# EAGLE design countdown4digit (EAGLE 6.4)
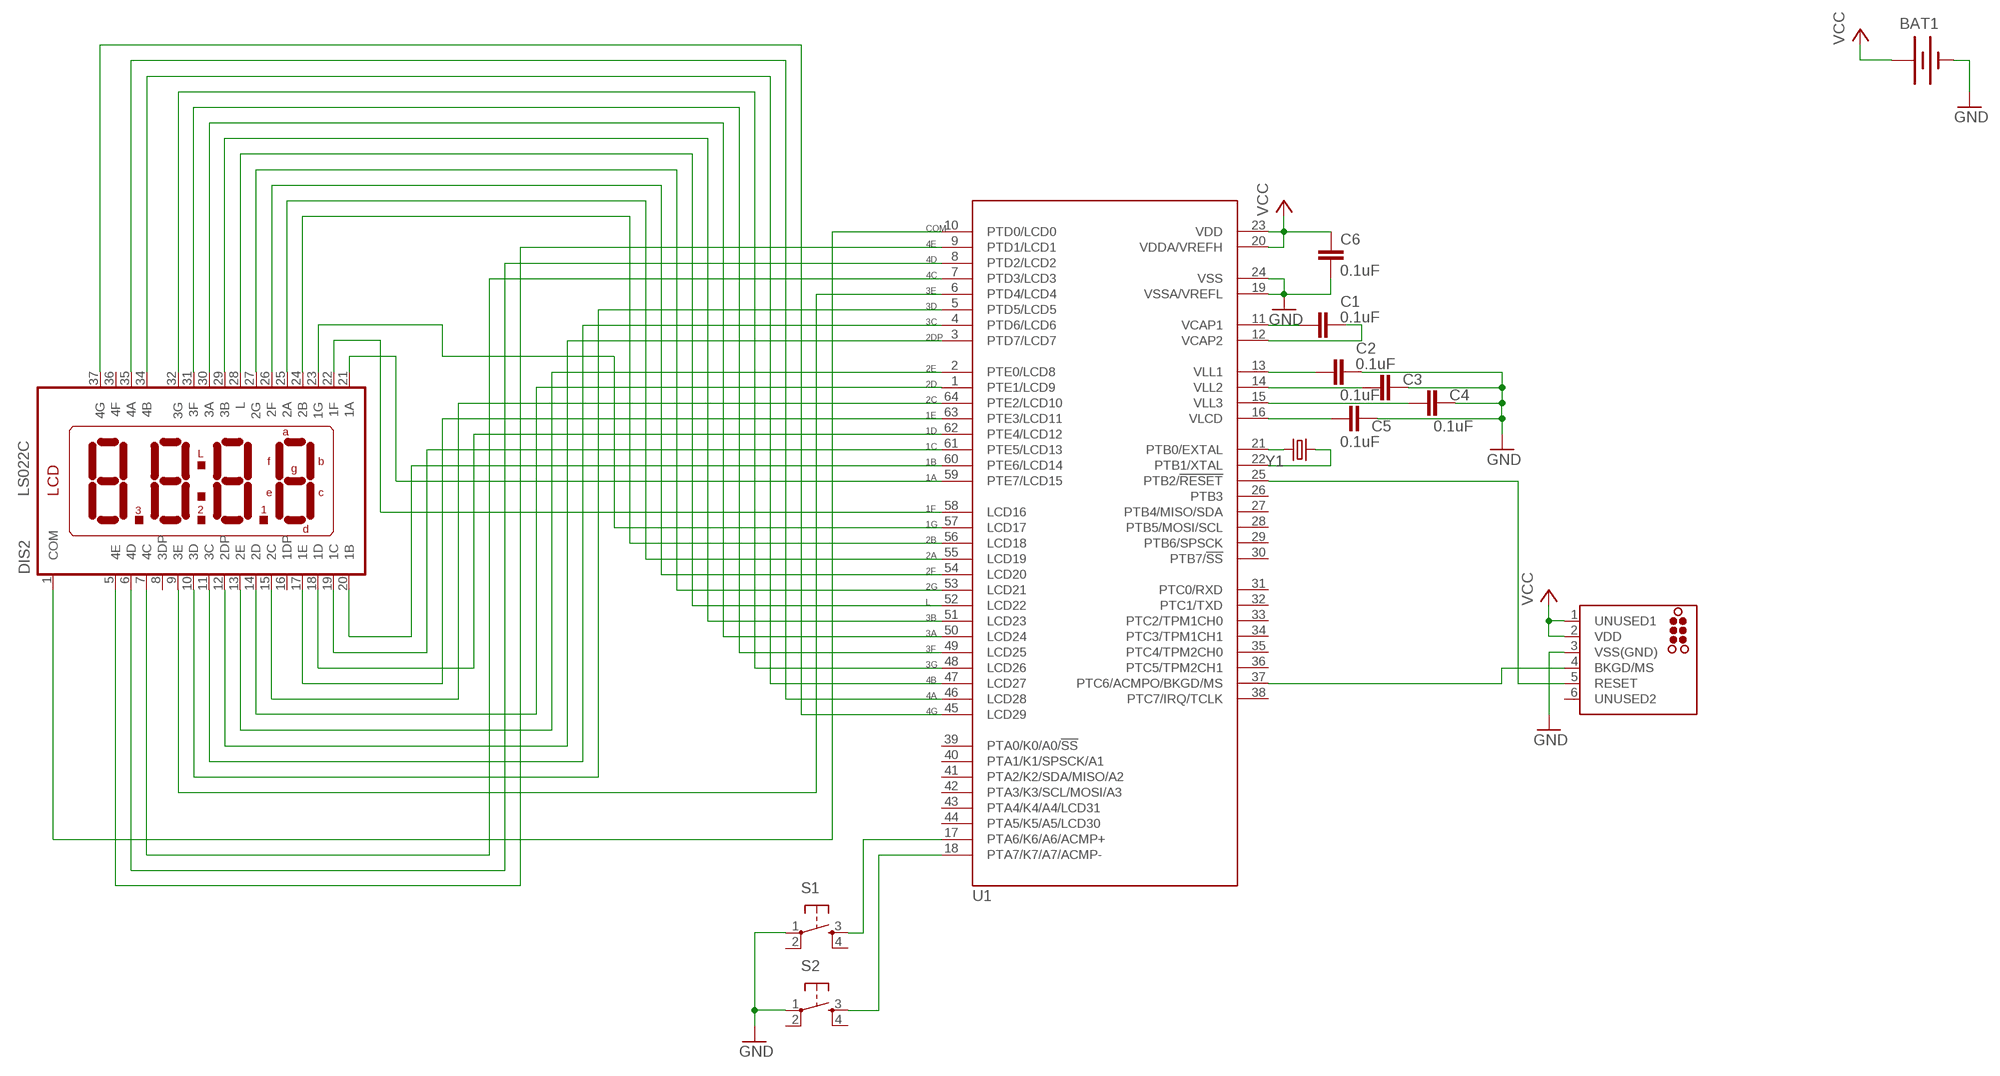
[diagram p0: schematic, sheet 1]

## Parts
BAT1  BATTERY12MM  [BATTCON_12MM]
BDM  TC2030-MCP-NL  [TC2030-MCP-NL]
C1  0.1uF  C-EUC0603K  [C0603K]
C2  0.1uF  C-EUC0603K  [C0603K]
C3  0.1uF  C-EUC0603K  [C0603K]
C4  0.1uF  C-EUC0603K  [C0603K]
C5  0.1uF  C-EUC0603K  [C0603K]
C6  0.1uF  C-EUC0603K  [C0603K]
DIS2  LS022C  [LS022C]
S1  TAC_SWITCHSMD  [TACTILE_SWITCH_SMD]
S2  TAC_SWITCHSMD  [TACTILE_SWITCH_SMD]
U1  MC9S08LL16  [LQFP64]
Y1  CRYSTALTC26H  [TC26H]

## Nets
1A: DIS2.21(1A) U1.59(PTE7/LCD15)
1B: DIS2.20(1B) U1.60(PTE6/LCD14)
1C: DIS2.19(1C) U1.61(PTE5/LCD13)
1D: DIS2.18(1D) U1.62(PTE4/LCD12)
1E: DIS2.17(1E) U1.63(PTE3/LCD11)
1F: DIS2.22(1F) U1.58(LCD16)
1G: DIS2.23(1G) U1.57(LCD17)
2A: DIS2.25(2A) U1.55(LCD19)
2B: DIS2.24(2B) U1.56(LCD18)
2C: DIS2.15(2C) U1.64(PTE2/LCD10)
2D: DIS2.14(2D) U1.1(PTE1/LCD9)
2DP: DIS2.12(2DP) U1.3(PTD7/LCD7)
2E: DIS2.13(2E) U1.2(PTE0/LCD8)
2F: DIS2.26(2F) U1.54(LCD20)
2G: DIS2.27(2G) U1.53(LCD21)
3A: DIS2.30(3A) U1.50(LCD24)
3B: DIS2.29(3B) U1.51(LCD23)
3C: DIS2.11(3C) U1.4(PTD6/LCD6)
3D: DIS2.10(3D) U1.5(PTD5/LCD5)
3E: DIS2.9(3E) U1.6(PTD4/LCD4)
3F: DIS2.31(3F) U1.49(LCD25)
3G: DIS2.32(3G) U1.48(LCD26)
4A: DIS2.35(4A) U1.46(LCD28)
4B: DIS2.34(4B) U1.47(LCD27)
4C: DIS2.7(4C) U1.7(PTD3/LCD3)
4D: DIS2.6(4D) U1.8(PTD2/LCD2)
4E: DIS2.5(4E) U1.9(PTD1/LCD1)
4G: DIS2.37(4G) U1.45(LCD29)
COM: DIS2.1(COM) U1.10(PTD0/LCD0)
GND: BAT1.GND(-) BDM.3(VSS(GND)) C2.1 C3.1 C4.1 C5.1 C6.2 S1.1 S2.1 U1.19(VSSA/VREFL) U1.24(VSS)
L: DIS2.28(L) U1.52(LCD22)
N$31: C1.2 U1.11(VCAP1)
N$32: C1.1 U1.12(VCAP2)
N$33: C2.2 U1.13(VLL1)
N$34: C3.2 U1.14(VLL2)
N$35: C4.2 U1.15(VLL3)
N$36: C5.2 U1.16(VLCD)
N$37: U1.21(PTB0/EXTAL) Y1.2
N$38: U1.22(PTB1/XTAL) Y1.1
N$39: BDM.4(BKGD/MS) U1.37(PTC6/ACMPO/BKGD/MS)
N$40: BDM.5(RESET) U1.25(PTB2/!RESET)
N$41: S1.3 U1.17(PTA6/K6/A6/ACMP+)
N$42: S2.3 U1.18(PTA7/K7/A7/ACMP-)
VCC: BAT1.PWR@1(+) BDM.1(UNUSED1) BDM.2(VDD) C6.1 U1.20(VDDA/VREFH) U1.23(VDD)
Unconnected: BDM.6(UNUSED2) DIS2.8(3DP) DIS2.16(1DP) DIS2.36(4F) S1.2 S1.4 S2.2 S2.4 U1.26(PTB3) U1.27(PTB4/MISO/SDA) U1.28(PTB5/MOSI/SCL) U1.29(PTB6/SPSCK) U1.30(PTB7/!SS) U1.31(PTC0/RXD) U1.32(PTC1/TXD) U1.33(PTC2/TPM1CH0) U1.34(PTC3/TPM1CH1) U1.35(PTC4/TPM2CH0) U1.36(PTC5/TPM2CH1) U1.38(PTC7/IRQ/TCLK) U1.39(PTA0/K0/A0/!SS) U1.40(PTA1/K1/SPSCK/A1) U1.41(PTA2/K2/SDA/MISO/A2) U1.42(PTA3/K3/SCL/MOSI/A3) U1.43(PTA4/K4/A4/LCD31) U1.44(PTA5/K5/A5/LCD30)

## Library data of the parts
BAT1 = SparkFun:BATTERY: Battery Holders Various common sizes : AA, AAA, 20mm coin cell and 12mm coin cell.
BDM = scott:TC2030: TAG-CONNECT ISP Connector Manufacturer: Tag-Connect <www.tag-connect.com> Cable for easy In-Circuit PCB Programming. Designed for Microchip ICD2, suitable for many others. Two variants - one "with legs" (for hads-free fit on PCB) and another "without legs" for quick programming. PAD Description 1 MCLR/Vpp 2 Vdd 3 GND 4 PGD (ISPDAT) 5 PGC (ISPCLK) 6 nc (used for LVP) ©2009 ROFA.cz
C1-C6 = rcl:C-EU: CAPACITOR, European symbol
DIS2 = display-lcd:LS022C: LCD DISPLAY 4-character 7 segment; OC_FARNELL: unknown; OC_NEWARK: unknown
S1 S2 = SparkFun:TAC_SWITCH: Momentary Switch Button commonly used for reset or general input. Spark Fun Electronics SKU : COM-00097
U1 = scott:MC9S08LL16
Y1 = crystal:CRYSTAL: CRYSTAL; OC_FARNELL: unknown; OC_NEWARK: unknown

## Board
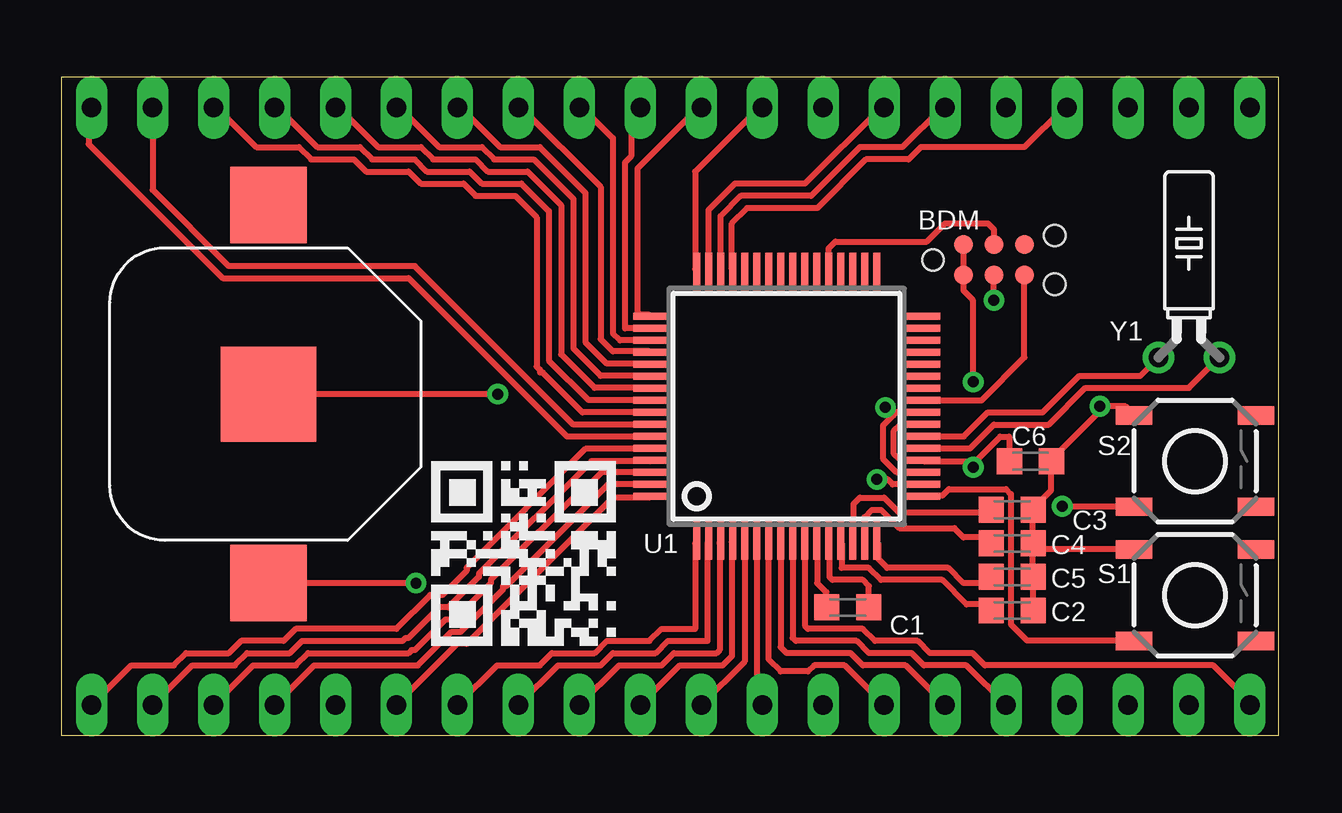
[diagram p1: board, top side]
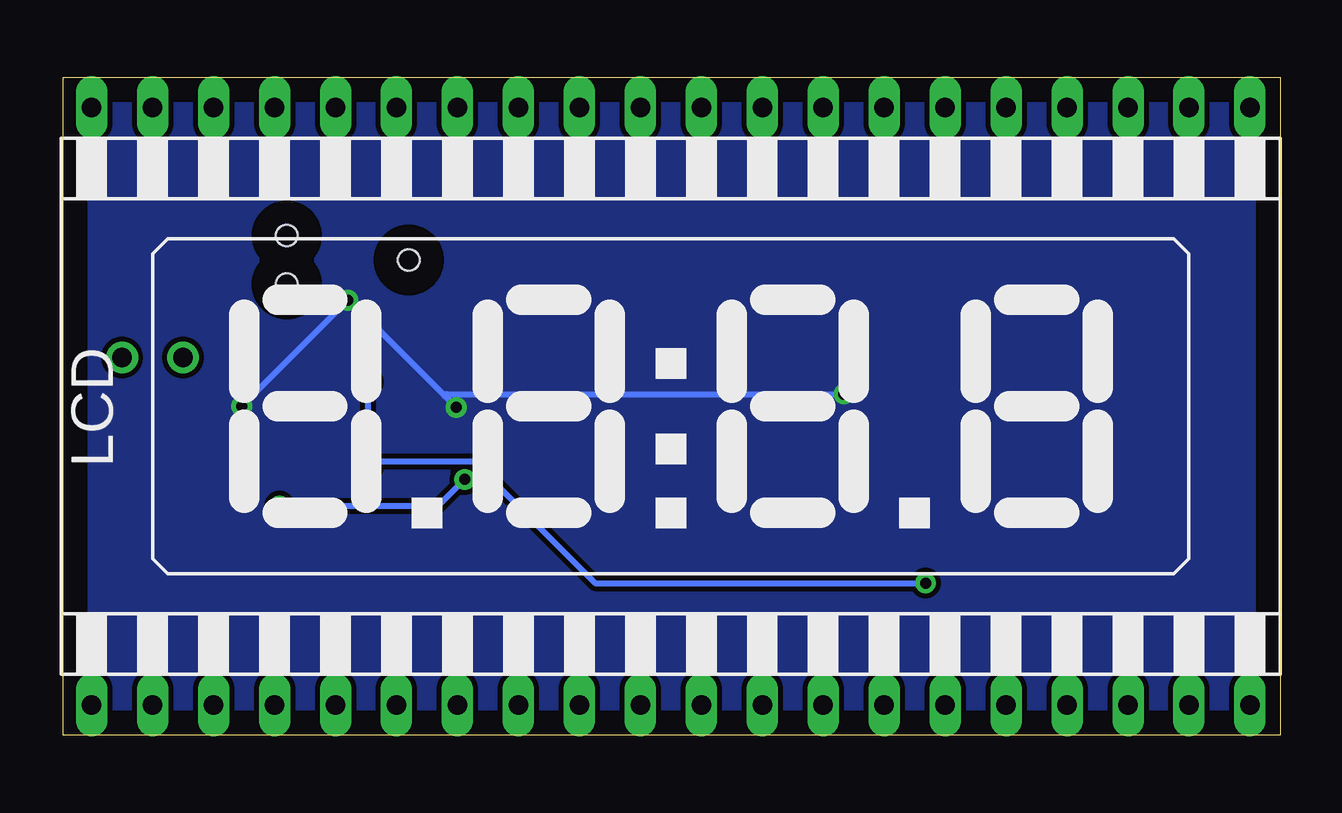
[diagram p2: board, bottom side, seen from below]

Size 50.72 x 27.42 mm. Coordinates in mm from the lower left corner, seen from the top.
Outline: 0,0 50.72,0 50.72,27.42 0,27.42 0,0
Copper layers (1*16): Top 0.035mm / dielectric 1.5mm / Bottom 0.035mm
Design rules "default *": minimum track width 10mil, minimum drill 18mil, track to track 8mil, track to pad 6mil, pad to pad 6mil, via to via 8mil, smd to smd 6mil, copper to edge 40mil, drill to drill 8mil, minimum pad ring 10mil, minimum via ring 8mil, stop-mask expansion 4mil, vias tented up to drill 0mil, thermal gap 10mil

### Footprints (pad centres in the part's own frame; a part is rotated, then mirrored left to right if it is on the bottom)
BATTCON_12MM = smd 3.962 x 3.962: GND 0,0 | smd 3.175 x 3.175: PWR@1 -7.874,0; PWR@2 7.874,0
TC2030-MCP-NL = smd 0.787 x 0.787: 1 1.27,-0.635; 2 1.27,0.635; 3 2.54,-0.635; 4 2.54,0.635; 5 3.81,-0.635; 6 3.81,0.635 | hole 0.889: 0,0; 5.08,-1.016; 5.08,1.016
C0603K = smd 1.05 x 1.08: 1 -0.875,0; 2 0.875,0
LS022C = drill 0.813 long: 1 -24.13,-12.446; 2 -21.59,-12.446; 3 -19.05,-12.446; 4 -16.51,-12.446; 5 -13.97,-12.446; 6 -11.43,-12.446; 7 -8.89,-12.446; 8 -6.35,-12.446; 9 -3.81,-12.446; 10 -1.27,-12.446; 11 1.27,-12.446; 12 3.81,-12.446; 13 6.35,-12.446; 14 8.89,-12.446; 15 11.43,-12.446; 16 13.97,-12.446; 17 16.51,-12.446; 18 19.05,-12.446; 19 21.59,-12.446; 20 24.13,-12.446; 21 24.13,12.446; 22 21.59,12.446; 23 19.05,12.446; 24 16.51,12.446; 25 13.97,12.446; 26 11.43,12.446; 27 8.89,12.446; 28 6.35,12.446; 29 3.81,12.446; 30 1.27,12.446; 31 -1.27,12.446; 32 -3.81,12.446; 33 -6.35,12.446; 34 -8.89,12.446; 35 -11.43,12.446; 36 -13.97,12.446; 37 -16.51,12.446; 38 -19.05,12.446; 39 -21.59,12.446; 40 -24.13,12.446
TACTILE_SWITCH_SMD = smd 1.524 x 0.762: 1 -2.54,1.905; 2 2.54,1.905; 3 -2.54,-1.905; 4 2.54,-1.905
LQFP64 = smd 0.3 x 1.6: 1 -3.75,-5.6; 2 -3.25,-5.6; 3 -2.75,-5.6; 4 -2.25,-5.6; 5 -1.75,-5.6; 6 -1.25,-5.6; 7 -0.75,-5.6; 8 -0.25,-5.6; 9 0.25,-5.6; 10 0.75,-5.6; 11 1.25,-5.6; 12 1.75,-5.6; 13 2.25,-5.6; 14 2.75,-5.6; 15 3.25,-5.6; 16 3.75,-5.6; 33 3.75,5.6; 34 3.25,5.6; 35 2.75,5.6; 36 2.25,5.6; 37 1.75,5.6; 38 1.25,5.6; 39 0.75,5.6; 40 0.25,5.6; 41 -0.25,5.6; 42 -0.75,5.6; 43 -1.25,5.6; 44 -1.75,5.6; 45 -2.25,5.6; 46 -2.75,5.6; 47 -3.25,5.6; 48 -3.75,5.6 | smd 1.6 x 0.3: 17 5.6,-3.75; 18 5.6,-3.25; 19 5.6,-2.75; 20 5.6,-2.25; 21 5.6,-1.75; 22 5.6,-1.25; 23 5.6,-0.75; 24 5.6,-0.25; 25 5.6,0.25; 26 5.6,0.75; 27 5.6,1.25; 28 5.6,1.75; 29 5.6,2.25; 30 5.6,2.75; 31 5.6,3.25; 32 5.6,3.75; 49 -5.6,3.75; 50 -5.6,3.25; 51 -5.6,2.75; 52 -5.6,2.25; 53 -5.6,1.75; 54 -5.6,1.25; 55 -5.6,0.75; 56 -5.6,0.25; 57 -5.6,-0.25; 58 -5.6,-0.75; 59 -5.6,-1.25; 60 -5.6,-1.75; 61 -5.6,-2.25; 62 -5.6,-2.75; 63 -5.6,-3.25; 64 -5.6,-3.75
TC26H = drill 0.813: 1 -1.27,0; 2 1.27,0

### Placement (x,y rotation side)
BAT1  8.64,14.22 90 top
BDM  36.32,19.81 0 top
C1  32.77,5.33 180 top
C2  39.62,5.21 180 top
C3  39.62,9.4 180 top
C4  39.62,8 180 top
C5  39.62,6.6 180 top
C6  40.39,11.43 0 top
DIS2  25.4,13.72 0 bottom
S1  47.24,5.84 0 top
S2  47.24,11.43 0 top
U1  30.23,13.72 0 top
U$1  [QR-CODE-L-MED]  15.24,3.56 0 top
Y1  46.99,15.75 0 top

### Tracks (layer width: path | path; a pad name or v marks a point on that pad's centre or on a via)
1A
  Top 0.254: U1.59 24.51,12.45 21.08,12.45 14.48,19.05 6.73,19.05 1.14,24.64 1.14,26.16 DIS2.21
1B
  Top 0.254: DIS2.20 2.92,2.92 4.7,2.92 5.21,3.43 6.99,3.43 7.49,3.94 9.27,3.94 9.78,4.45 13.97,4.45 15.37,5.84 15.88,5.84 16.89,6.86 16.89,6.98 21.84,11.94 24.51,11.94 U1.60
1C
  Top 0.254: DIS2.19 5.46,2.92 7.24,2.92 7.75,3.43 9.53,3.43 10.03,3.94 14.22,3.94 14.35,4.06 14.48,4.06 15.75,5.33 16.13,5.33 17.4,6.6 17.4,6.73 22.1,11.43 24.51,11.43 U1.61
1D
  Top 0.254: U1.62 22.52,10.97 22.1,10.54 21.97,10.54 17.91,6.48 17.91,6.35 16.38,4.83 16,4.83 14.73,3.56 14.6,3.56 14.48,3.43 10.29,3.43 9.78,2.92 8,2.92 DIS2.18
1E
  Top 0.254: U1.63 22.79,10.47 18.54,6.22 18.41,6.22 18.41,6.1 16.64,4.32 16.26,4.32 14.86,2.92 10.54,2.92 DIS2.17
1F
  Top 0.254: U1.58 24.51,12.95 21.34,12.95 14.73,19.56 6.99,19.56 3.81,22.73 DIS2.22
1G
  Top 0.254: U1.57 24.51,13.46 21.72,13.46 20.07,15.11 19.94,15.11 19.94,15.24 19.81,15.37 19.81,21.59 18.92,22.48 17.27,22.48 16.76,22.99 14.99,22.99 14.48,23.5 12.7,23.5 12.19,24 10.41,24 9.91,24.51 8.13,24.51 6.48,26.16 DIS2.23
2A
  Top 0.254: U1.55 24.51,14.48 22.22,14.48 20.83,15.88 20.83,22.1 19.43,23.5 17.78,23.5 17.27,24 15.49,24 14.99,24.51 13.21,24.51 11.56,26.16 DIS2.25
2B
  Top 0.254: U1.56 24.51,13.97 21.97,13.97 20.32,15.62 20.32,21.84 19.18,22.99 17.53,22.99 17.02,23.5 15.24,23.5 14.73,24 12.95,24 12.45,24.51 10.67,24.51 9.02,26.16 DIS2.24
2C
  Top 0.254: U1.64 24.51,9.91 22.99,9.91 16.89,3.81 16.51,3.81 DIS2.15
2D
  Top 0.254: U1.1 26.42,8 26.42,4.45 25.02,4.45 24.51,3.94 22.73,3.94 22.22,3.43 20.45,3.43 19.94,2.92 18.16,2.92 DIS2.14
2DP
  Top 0.254: U1.3 27.43,8 27.43,3.56 27.3,3.43 25.53,3.43 25.02,2.92 23.24,2.92 DIS2.12
2E
  Top 0.254: DIS2.13 20.7,2.92 22.48,2.92 22.99,3.43 24.76,3.43 25.27,3.94 26.92,3.94 26.92,8 U1.2
2F
  Top 0.254: U1.54 24.51,14.99 22.48,14.99 21.34,16.13 21.34,22.35 19.68,24 18.03,24 17.53,24.51 15.75,24.51 14.1,26.16 DIS2.26
2G
  Top 0.254: DIS2.27 16.64,26.16 18.29,24.51 19.94,24.51 21.84,22.61 21.84,16.38 22.73,15.49 24.51,15.49 U1.53
3A
  Top 0.254: U1.50 23.49,16.97 23.49,23.88 23.75,24.13 23.75,25.91 24,26.16 DIS2.30
3B
  Top 0.254: U1.51 23.29,16.47 22.99,16.76 22.99,24.89 21.72,26.16 DIS2.29
3C
  Top 0.254: U1.4 27.94,8 27.94,3.3 27.56,2.92 25.78,2.92 DIS2.11
3D
  Top 0.254: U1.5 28.48,3.08 DIS2.10
3E
  Top 0.254: U1.6 28.98,1.5 DIS2.9
3F
  Top 0.254: U1.49 24.51,17.53 24.13,17.53 24,17.65 24,23.62 26.54,26.16 DIS2.31
3G
  Top 0.254: DIS2.32 29.08,26.16 26.42,23.5 26.42,19.43 U1.48
4A
  Top 0.254: U1.46 27.48,21.63 28.32,22.48 31.24,22.48 33.27,24.51 35.05,24.51 36.7,26.16 DIS2.35
4B
  Top 0.254: U1.47 26.98,21.9 28.07,22.99 30.99,22.99 34.16,26.16 DIS2.34
4C
  Top 0.254: U1.7 29.46,8 29.46,3.17 29.97,2.67 31.12,2.67 31.37,2.92 32.64,2.92 DIS2.7
4D
  Top 0.254: U1.8 29.97,8 29.97,3.68 30.23,3.43 32.89,3.43 33.4,2.92 35.18,2.92 DIS2.6
4E
  Top 0.254: U1.9 30.48,8 30.48,4.06 30.61,3.94 33.15,3.94 33.66,3.43 35.43,3.43 35.94,2.92 37.72,2.92 DIS2.5
4G
  Top 0.254: U1.45 27.94,19.43 27.94,21.34 28.57,21.97 31.5,21.97 33.53,24 35.31,24 35.81,24.51 40.13,24.51 41.78,26.16 DIS2.37
COM
  Top 0.254: U1.10 30.99,8 30.99,4.57 31.12,4.45 33.4,4.45 33.91,3.94 35.69,3.94 36.2,3.43 37.97,3.43 38.48,2.92 48.01,2.92 49.53,1.4 DIS2.1
GND  (via drill 0.46)
  Top 0.254: C2.1 40.49,5.23 C5.1 40.49,6.71 40.49,7.98 C4.1 | C4.1 40.49,8.13 C3.1 40.54,9.5 41.25,10.21 41.25,11.43 C6.2 41.3,11.53 43.38,13.61 v43.28,13.72 44.35,13.72 44.7,13.36 S2.1 | S1.1 44.7,7.77 40.59,7.77 C4.1 | 34.67,13.34 34.8,13.46 U1.24 | 34.67,13.34 34.24,12.9 34.24,11.53 34.8,10.97 U1.19 | v38.86,18.14 BDM.3 | v34.34,13.66 34.67,13.34 | v18.19,14.22 BAT1.GND
  Bottom 0.254: v43.28,13.72 v38.86,18.14 38.76,18.09 34.82,14.15 | 34.82,14.15 v34.34,13.66 | v18.19,14.22 34.75,14.22 34.82,14.15
  pour Bottom: 0.13,27.18 50.55,27.18 50.55,0.13 0.13,0.13 0.13,27.05
L
  Top 0.254: DIS2.28 19.18,26.16 22.48,22.86 22.48,16.51 22.99,16 24.51,16 U1.52
N$31
  Top 0.254: C1.2 31.88,5.33 31.88,5.97 31.5,6.35 31.5,8 U1.11
N$32
  Top 0.254: U1.12 32,8 32,6.6 32.13,6.48 33.4,6.48 33.66,6.22 33.66,5.33 C1.1
N$33
  Top 0.254: U1.13 32.51,8 32.51,6.98 33.66,6.98 34.16,6.48 36.7,6.48 37.72,5.46 38.61,5.46 38.86,5.21 C2.2
N$34
  Top 0.254: U1.14 33.02,8.13 33.02,9.65 33.27,9.91 34.29,9.91 34.92,9.27 38.73,9.27 38.86,9.4 C3.2
N$35
  Top 0.254: U1.15 33.48,9.09 33.78,9.4 34.16,9.4 34.92,8.64 37.21,8.64 37.59,8.26 38.73,8.26 C4.2
N$36
  Top 0.254: U1.16 34.04,8 34.04,7.37 34.42,6.98 36.96,6.98 37.59,6.35 38.61,6.35 38.86,6.6 C5.2
N$37
  Top 0.254: U1.21 37.87,11.97 38.86,12.95 41.15,12.95 42.67,14.48 46.99,14.48 Y1.2
N$38
  Top 0.254: U1.22 37.61,12.47 38.61,13.46 40.89,13.46 42.42,14.99 44.96,14.99 Y1.1
N$39
  Top 0.254: U1.37 31.98,20.29 32.26,20.57 36.07,20.57 36.83,21.34 38.61,21.34 38.86,21.08 BDM.4
N$40
  Top 0.254: U1.25 38.35,13.97 40.13,15.75 BDM.5
N$41
  Top 0.254: S1.3 44.7,3.96 40.23,3.96 39.57,4.62 39.57,10.06 39.37,10.26 36.98,10.26 36.73,10.01 35.87,10.01 U1.17
N$42  (via drill 0.46)
  Top 0.254: v41.71,9.55 44.7,9.55 S2.3 | v33.98,10.67 34.44,10.67 34.65,10.46 U1.18
  Bottom 0.254: v41.71,9.55 35.1,9.55 v33.98,10.67
VCC  (via drill 0.46)
  Top 0.254: BDM.2 BDM.1 37.59,18.54 37.97,18.16 38,18.09 v38,14.73 | 38,11.43 35.94,11.43 U1.20 35.71,11.48 34.95,11.48 34.7,11.73 34.7,12.7 34.95,12.95 35.81,12.95 U1.23 | 38,11.43 38.1,11.43 39.12,12.45 39.5,12.45 39.5,11.43 C6.1 | 38,11.43 v38,11.18 | v14.78,6.35 BAT1.PWR@1
  Bottom 0.254: v38,14.73 v38,11.18 37.9,11.43 33.63,11.43 28.55,6.35 v14.78,6.35